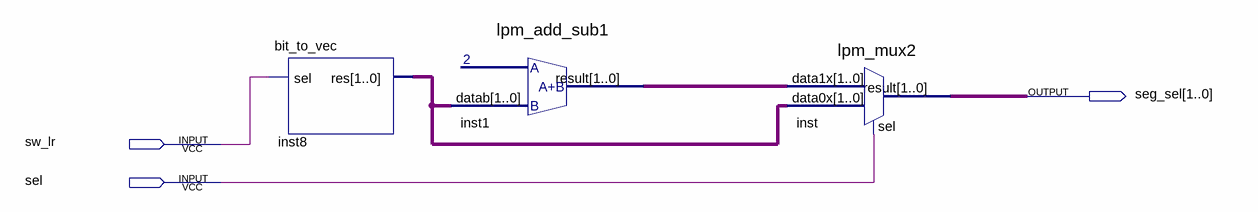
[diagram p0: schematic sheet]
// Quartus schematic load_sel.bdf as structural Verilog: 3 symbols, 3 pins
module load_sel (
  input  sw_lr,
  input  sel,
  output [1:0] seg_sel
);

  wire [1:0] inst1_result, inst8_res;

  bit_to_vec inst8 (.sel(sw_lr), .res(inst8_res));
  lpm_add_sub1 inst1 (.datab(inst8_res), .result(inst1_result));
  lpm_mux2 inst (.data1x(inst1_result), .data0x(inst8_res), .sel(sel), .result(seg_sel));
endmodule
